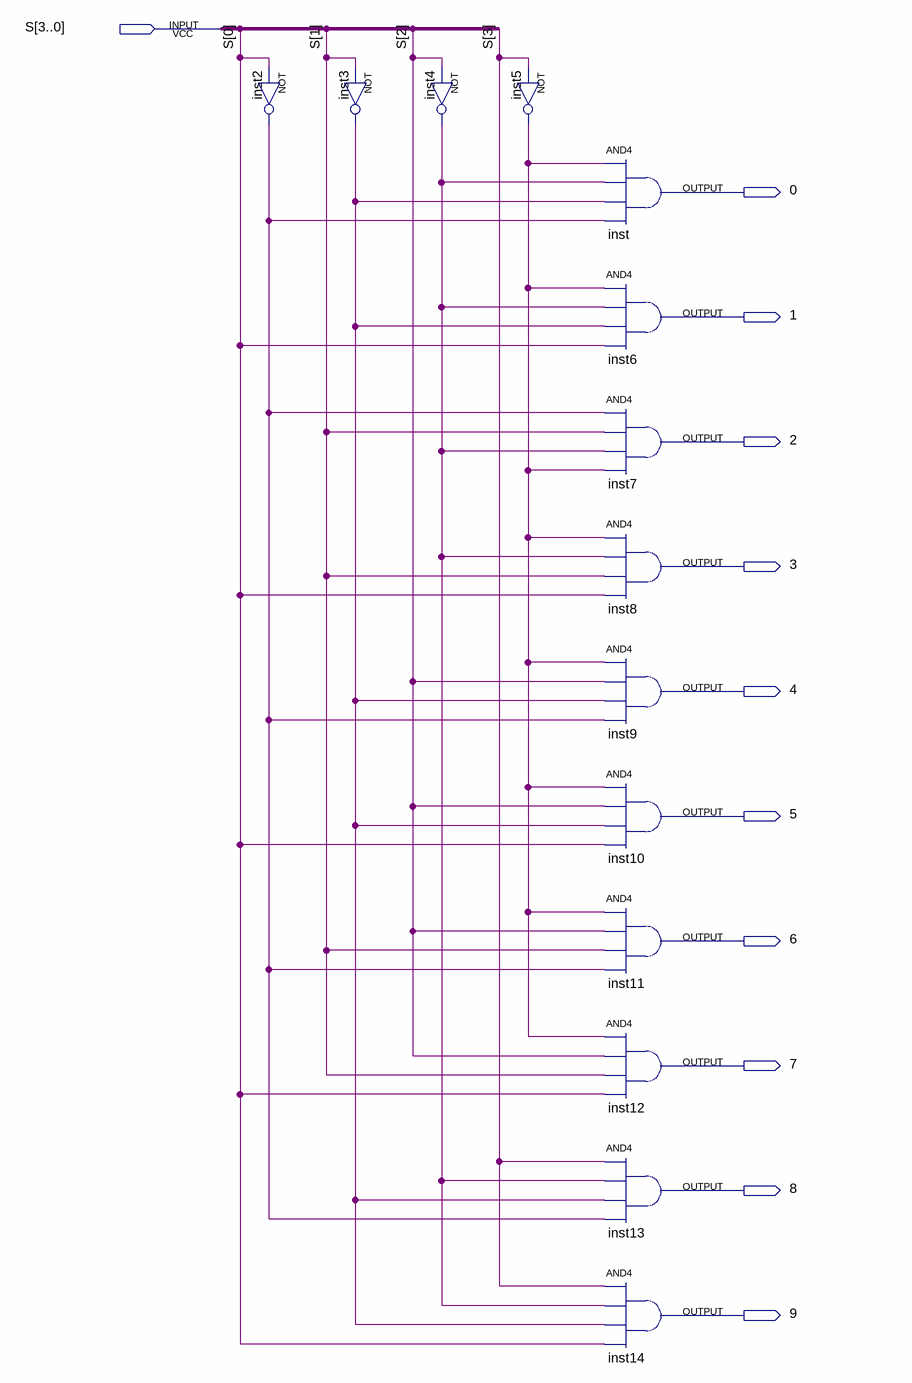
[diagram p0: schematic sheet]
// Quartus schematic BCD_demux.bdf as structural Verilog: 14 symbols, 11 pins
module BCD_demux (
  input  [3:0] S,
  output \0 ,
  output \1 ,
  output \2 ,
  output \3 ,
  output \4 ,
  output \5 ,
  output \6 ,
  output \7 ,
  output \8 ,
  output \9 
);

  wire inst2_out, inst3_out, inst4_out, inst5_out;

  not inst2 (inst2_out, S[0]);
  not inst3 (inst3_out, S[1]);
  not inst4 (inst4_out, S[2]);
  not inst5 (inst5_out, S[3]);
  and inst (\0 , inst5_out, inst4_out, inst3_out, inst2_out);
  and inst6 (\1 , inst5_out, inst4_out, inst3_out, S[0]);
  and inst7 (\2 , inst2_out, S[1], inst4_out, inst5_out);
  and inst8 (\3 , inst5_out, inst4_out, S[1], S[0]);
  and inst9 (\4 , inst5_out, S[2], inst3_out, inst2_out);
  and inst10 (\5 , inst5_out, S[2], inst3_out, S[0]);
  and inst11 (\6 , inst5_out, S[2], S[1], inst2_out);
  and inst12 (\7 , inst5_out, S[2], S[1], S[0]);
  and inst13 (\8 , S[3], inst4_out, inst3_out, inst2_out);
  and inst14 (\9 , S[3], inst4_out, inst3_out, S[0]);
endmodule
